# EAGLE schematic Current Sensor Board (EAGLE 7.1.0)
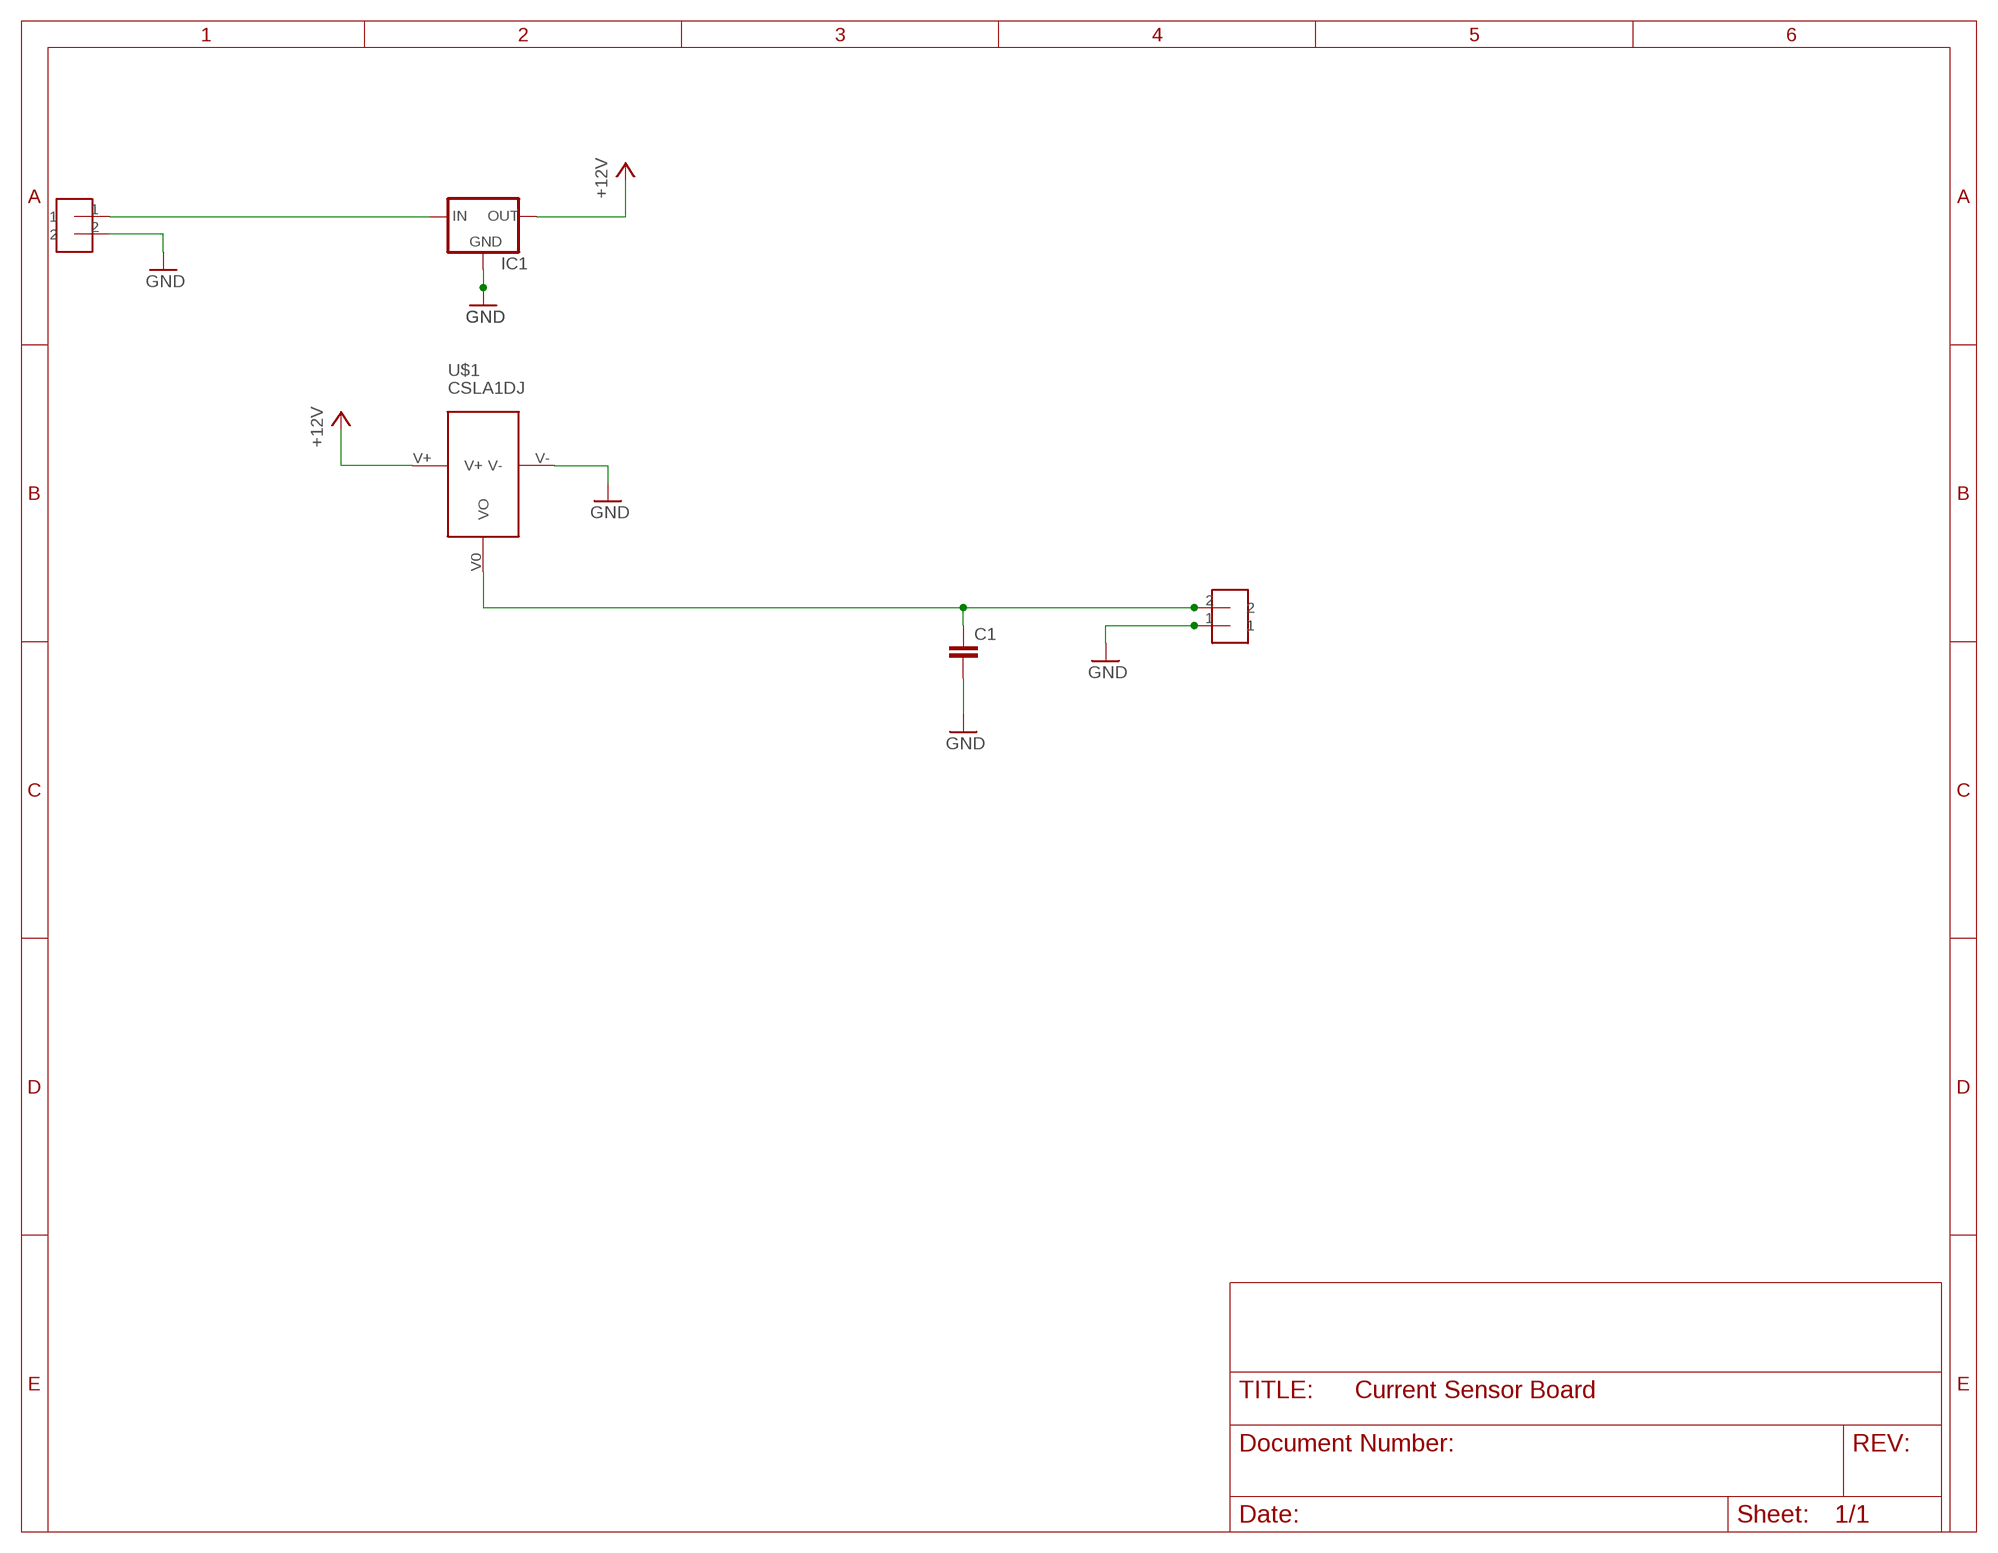
[diagram p0: schematic, sheet 1]

## Parts
C1  C-EU050-050X075  [C050-050X075]
IC1  78XXS  [78XXS]
U$1  CSLA1DJ  [CSLA1DJ]
U$2  1X2HEADER_100MIL  [1X2_100MIL]
U$3  1X2HEADER_100MIL  [1X2_100MIL]

## Nets
+12V: IC1.OUT U$1.V+
GND: C1.2 IC1.GND U$1.V- U$2.1 U$3.2
N$1: IC1.IN U$3.1
N$3: C1.1 U$1.V0(VO) U$2.2

## Library data of the parts
C1 = rcl:C-EU: CAPACITOR, European symbol
IC1 = v-reg:78XXS: VOLTAGE REGULATOR
U$1 = Current Sensors:CSLA1DJ
U$2 U$3 = Headers:1X2HEADER_100MIL